# EAGLE design SensorPod (EAGLE 9.5.2)

## Sheet 1 of 3
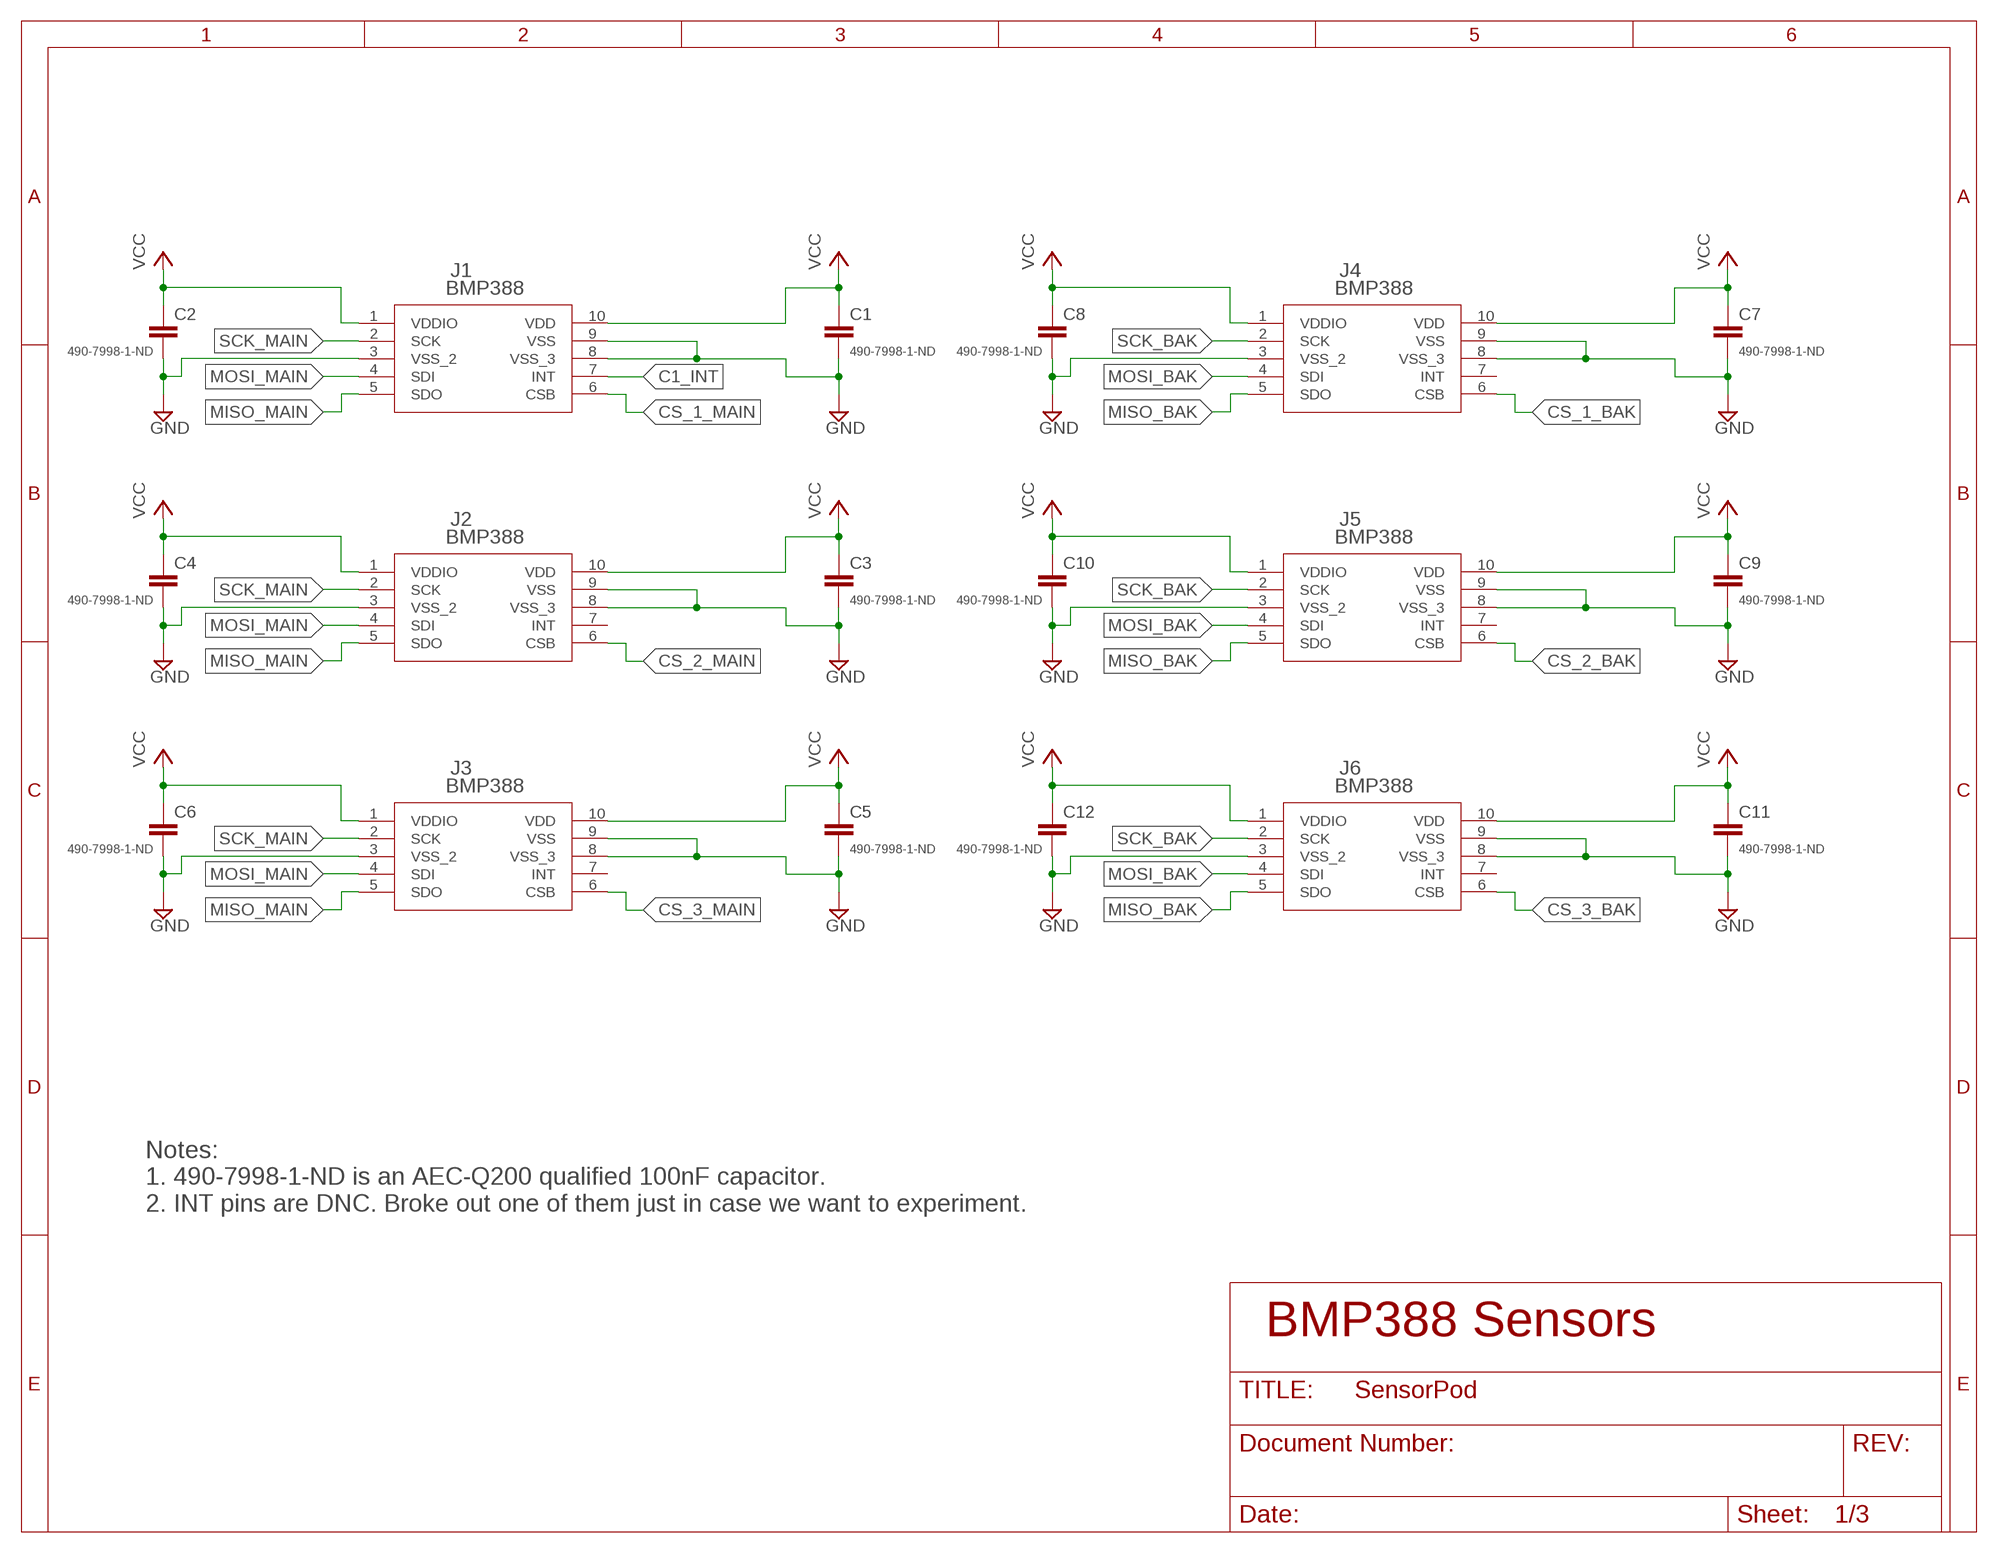
[diagram p0: schematic, sheet 1]

### Parts
C1  490-7998-1-ND  C-EUC0402  [C0402]
C2  490-7998-1-ND  C-EUC0402  [C0402]
C3  490-7998-1-ND  C-EUC0402  [C0402]
C4  490-7998-1-ND  C-EUC0402  [C0402]
C5  490-7998-1-ND  C-EUC0402  [C0402]
C6  490-7998-1-ND  C-EUC0402  [C0402]
C7  490-7998-1-ND  C-EUC0402  [C0402]
C8  490-7998-1-ND  C-EUC0402  [C0402]
C9  490-7998-1-ND  C-EUC0402  [C0402]
C10  490-7998-1-ND  C-EUC0402  [C0402]
C11  490-7998-1-ND  C-EUC0402  [C0402]
C12  490-7998-1-ND  C-EUC0402  [C0402]
J1  BMP388  [QFN_BMP388]
J2  BMP388  [QFN_BMP388]
J3  BMP388  [QFN_BMP388]
J4  BMP388  [QFN_BMP388]
J5  BMP388  [QFN_BMP388]
J6  BMP388  [QFN_BMP388]

### Nets
C1_INT: J1.7(INT) ; also sheet 2
CS_1_BAK: J4.6(CSB) ; also sheet 2
CS_1_MAIN: J1.6(CSB) ; also sheet 2
CS_2_BAK: J5.6(CSB) ; also sheet 2
CS_2_MAIN: J2.6(CSB) ; also sheet 2
CS_3_BAK: J6.6(CSB) ; also sheet 2
CS_3_MAIN: J3.6(CSB) ; also sheet 2
GND: C1.2 C2.2 C3.2 C4.2 C5.2 C6.2 C7.2 C8.2 C9.2 C10.2 C11.2 C12.2 J1.3(VSS_2) J1.8(VSS_3) J1.9(VSS) J2.3(VSS_2) J2.8(VSS_3) J2.9(VSS) J3.3(VSS_2) J3.8(VSS_3) J3.9(VSS) J4.3(VSS_2) J4.8(VSS_3) J4.9(VSS) J5.3(VSS_2) J5.8(VSS_3) J5.9(VSS) J6.3(VSS_2) J6.8(VSS_3) J6.9(VSS) ; also sheet 2,3
MISO_BAK: J4.5(SDO) J5.5(SDO) J6.5(SDO) ; also sheet 2
MISO_MAIN: J1.5(SDO) J2.5(SDO) J3.5(SDO) ; also sheet 2,3
MOSI_BAK: J4.4(SDI) J5.4(SDI) J6.4(SDI) ; also sheet 2
MOSI_MAIN: J1.4(SDI) J2.4(SDI) J3.4(SDI) ; also sheet 2,3
SCK_BAK: J4.2(SCK) J5.2(SCK) J6.2(SCK) ; also sheet 2
SCK_MAIN: J1.2(SCK) J2.2(SCK) J3.2(SCK) ; also sheet 2,3
VCC: C1.1 C2.1 C3.1 C4.1 C5.1 C6.1 C7.1 C8.1 C9.1 C10.1 C11.1 C12.1 J1.1(VDDIO) J1.10(VDD) J2.1(VDDIO) J2.10(VDD) J3.1(VDDIO) J3.10(VDD) J4.1(VDDIO) J4.10(VDD) J5.1(VDDIO) J5.10(VDD) J6.1(VDDIO) J6.10(VDD) ; also sheet 2,3
Unconnected: J2.7(INT) J3.7(INT) J4.7(INT) J5.7(INT) J6.7(INT)

### Notes on the sheet
- Notes:
  1. 490-7998-1-ND is an AEC-Q200 qualified 100nF capacitor.
  2. INT pins are DNC. Broke out one of them just in case we want to experiment.
- BMP388 Sensors

## Sheet 2 of 3
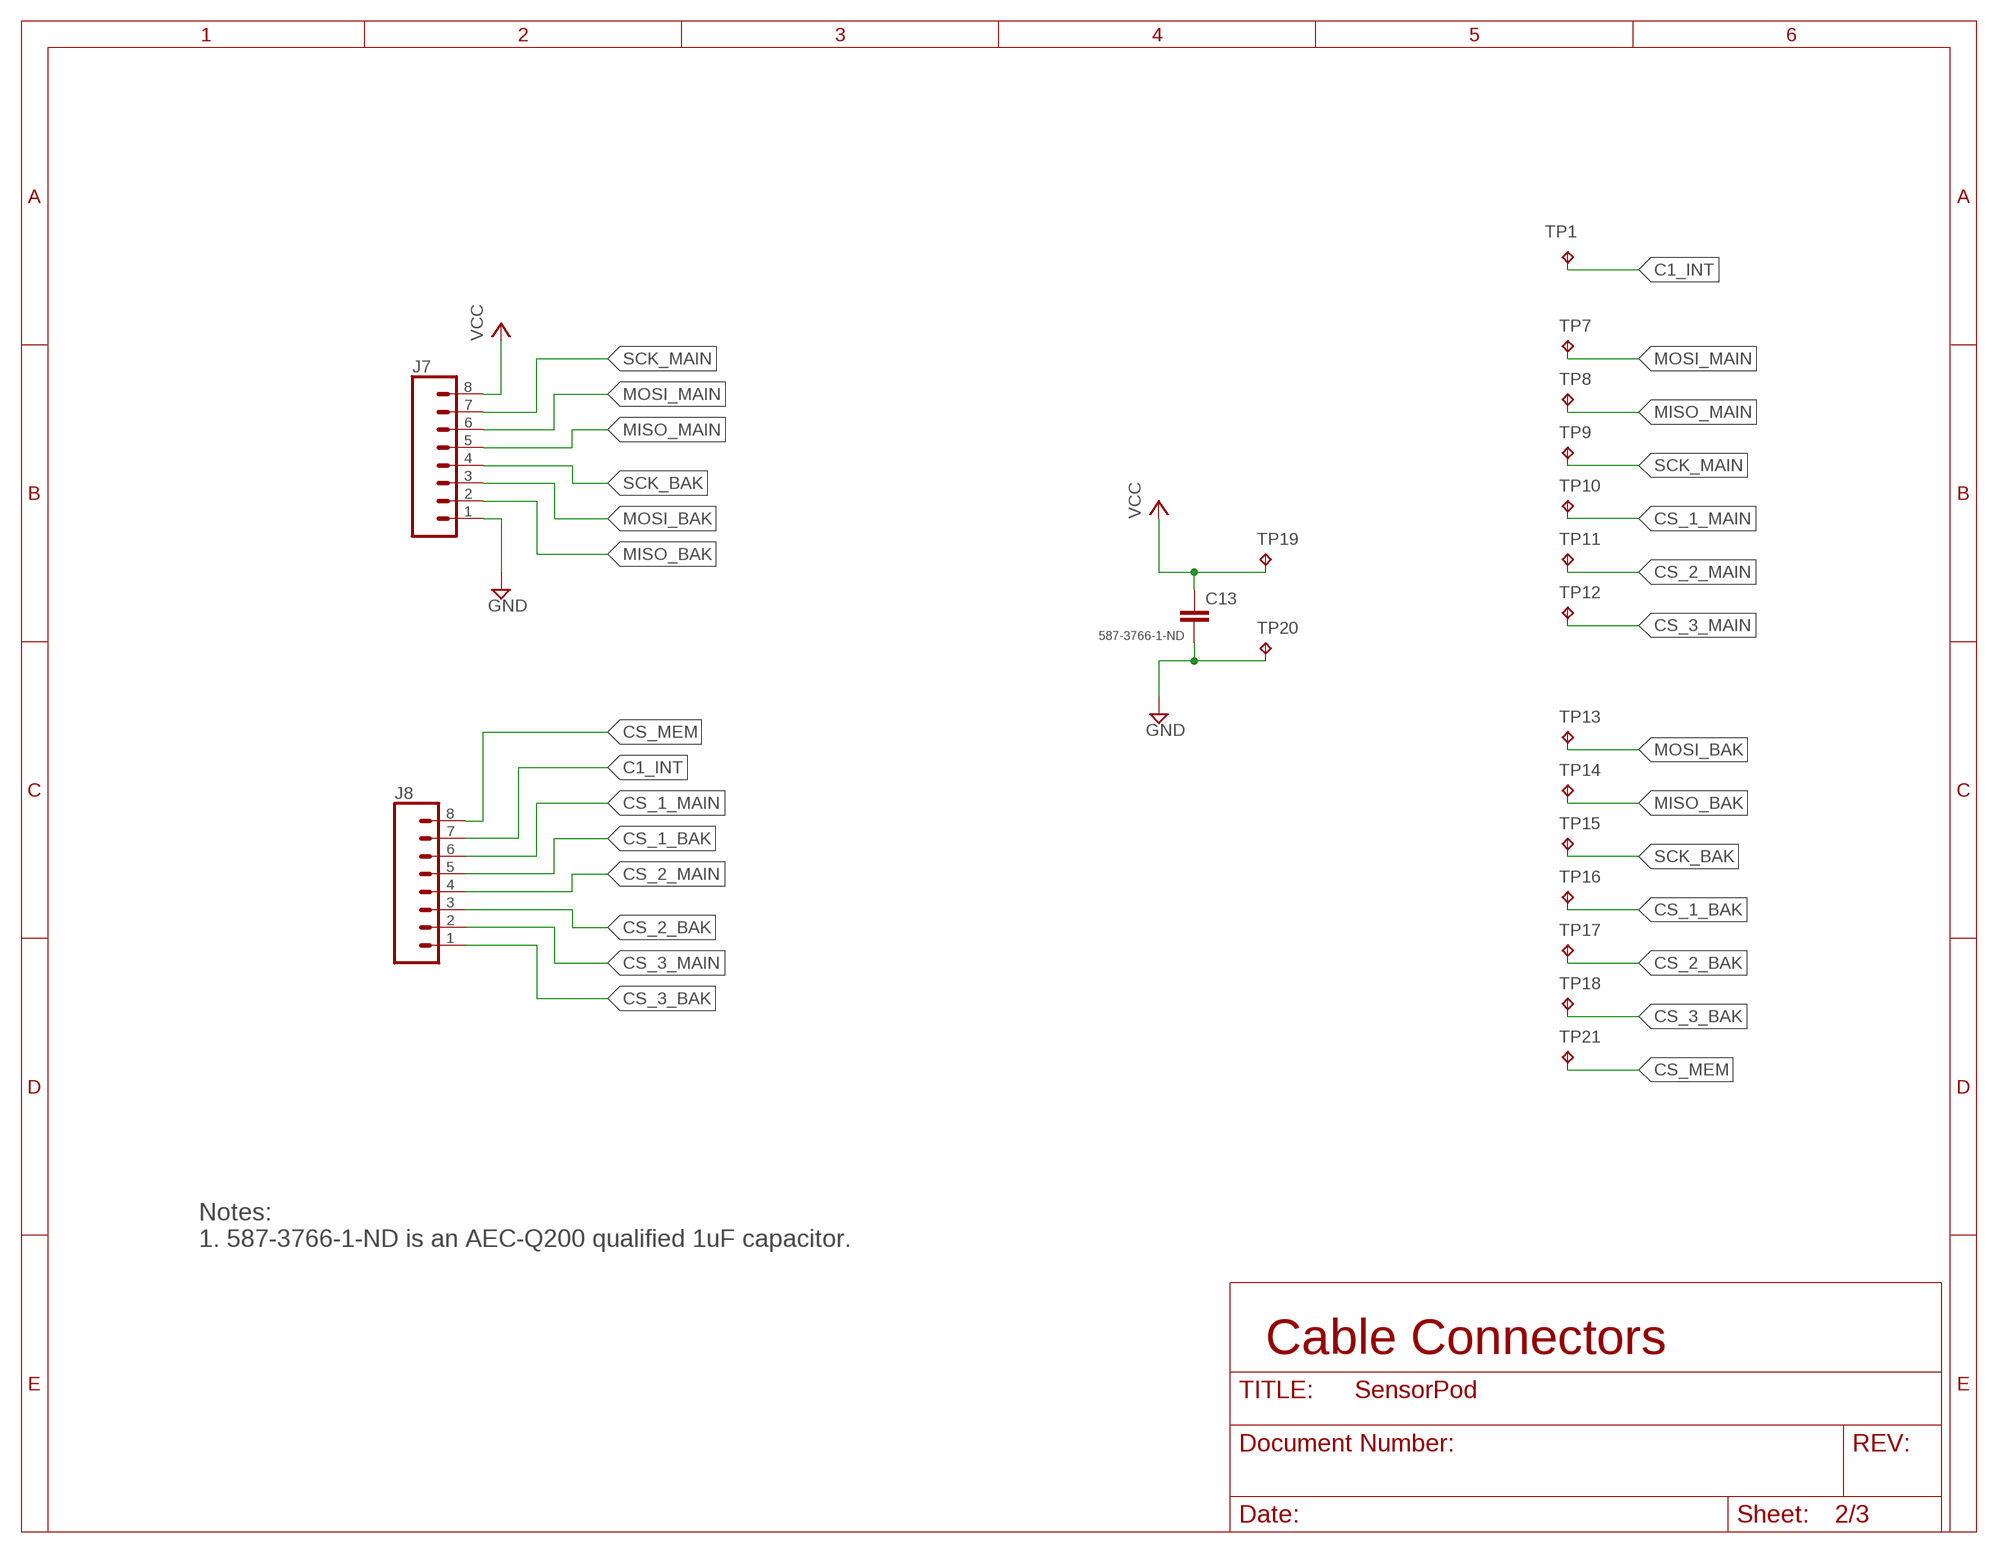
[diagram p1: schematic, sheet 2]

### Parts
C13  587-3766-1-ND  C-EUC0402  [C0402]
J7  CONN_08"  [1X08]
J8  CONN_08"  [1X08]
TP1  TPB1,27  [B1,27]
TP7  TPB1,27  [B1,27]
TP8  TPB1,27  [B1,27]
TP9  TPB1,27  [B1,27]
TP10  TPB1,27  [B1,27]
TP11  TPB1,27  [B1,27]
TP12  TPB1,27  [B1,27]
TP13  TPB1,27  [B1,27]
TP14  TPB1,27  [B1,27]
TP15  TPB1,27  [B1,27]
TP16  TPB1,27  [B1,27]
TP17  TPB1,27  [B1,27]
TP18  TPB1,27  [B1,27]
TP19  TPB1,27  [B1,27]
TP20  TPB1,27  [B1,27]
TP21  TPB1,27  [B1,27]

### Nets
C1_INT: J8.7 TP1.TP ; also sheet 1
CS_1_BAK: J8.5 TP16.TP ; also sheet 1
CS_1_MAIN: J8.6 TP10.TP ; also sheet 1
CS_2_BAK: J8.3 TP17.TP ; also sheet 1
CS_2_MAIN: J8.4 TP11.TP ; also sheet 1
CS_3_BAK: J8.1 TP18.TP ; also sheet 1
CS_3_MAIN: J8.2 TP12.TP ; also sheet 1
CS_MEM: J8.8 TP21.TP ; also sheet 3
GND: C13.2 J7.1 TP20.TP ; also sheet 1,3
MISO_BAK: J7.2 TP14.TP ; also sheet 1
MISO_MAIN: J7.5 TP8.TP ; also sheet 1,3
MOSI_BAK: J7.3 TP13.TP ; also sheet 1
MOSI_MAIN: J7.6 TP7.TP ; also sheet 1,3
SCK_BAK: J7.4 TP15.TP ; also sheet 1
SCK_MAIN: J7.7 TP9.TP ; also sheet 1,3
VCC: C13.1 J7.8 TP19.TP ; also sheet 1,3

### Notes on the sheet
- Notes:
  1. 587-3766-1-ND is an AEC-Q200 qualified 1uF capacitor.
- Cable Connectors

## Sheet 3 of 3
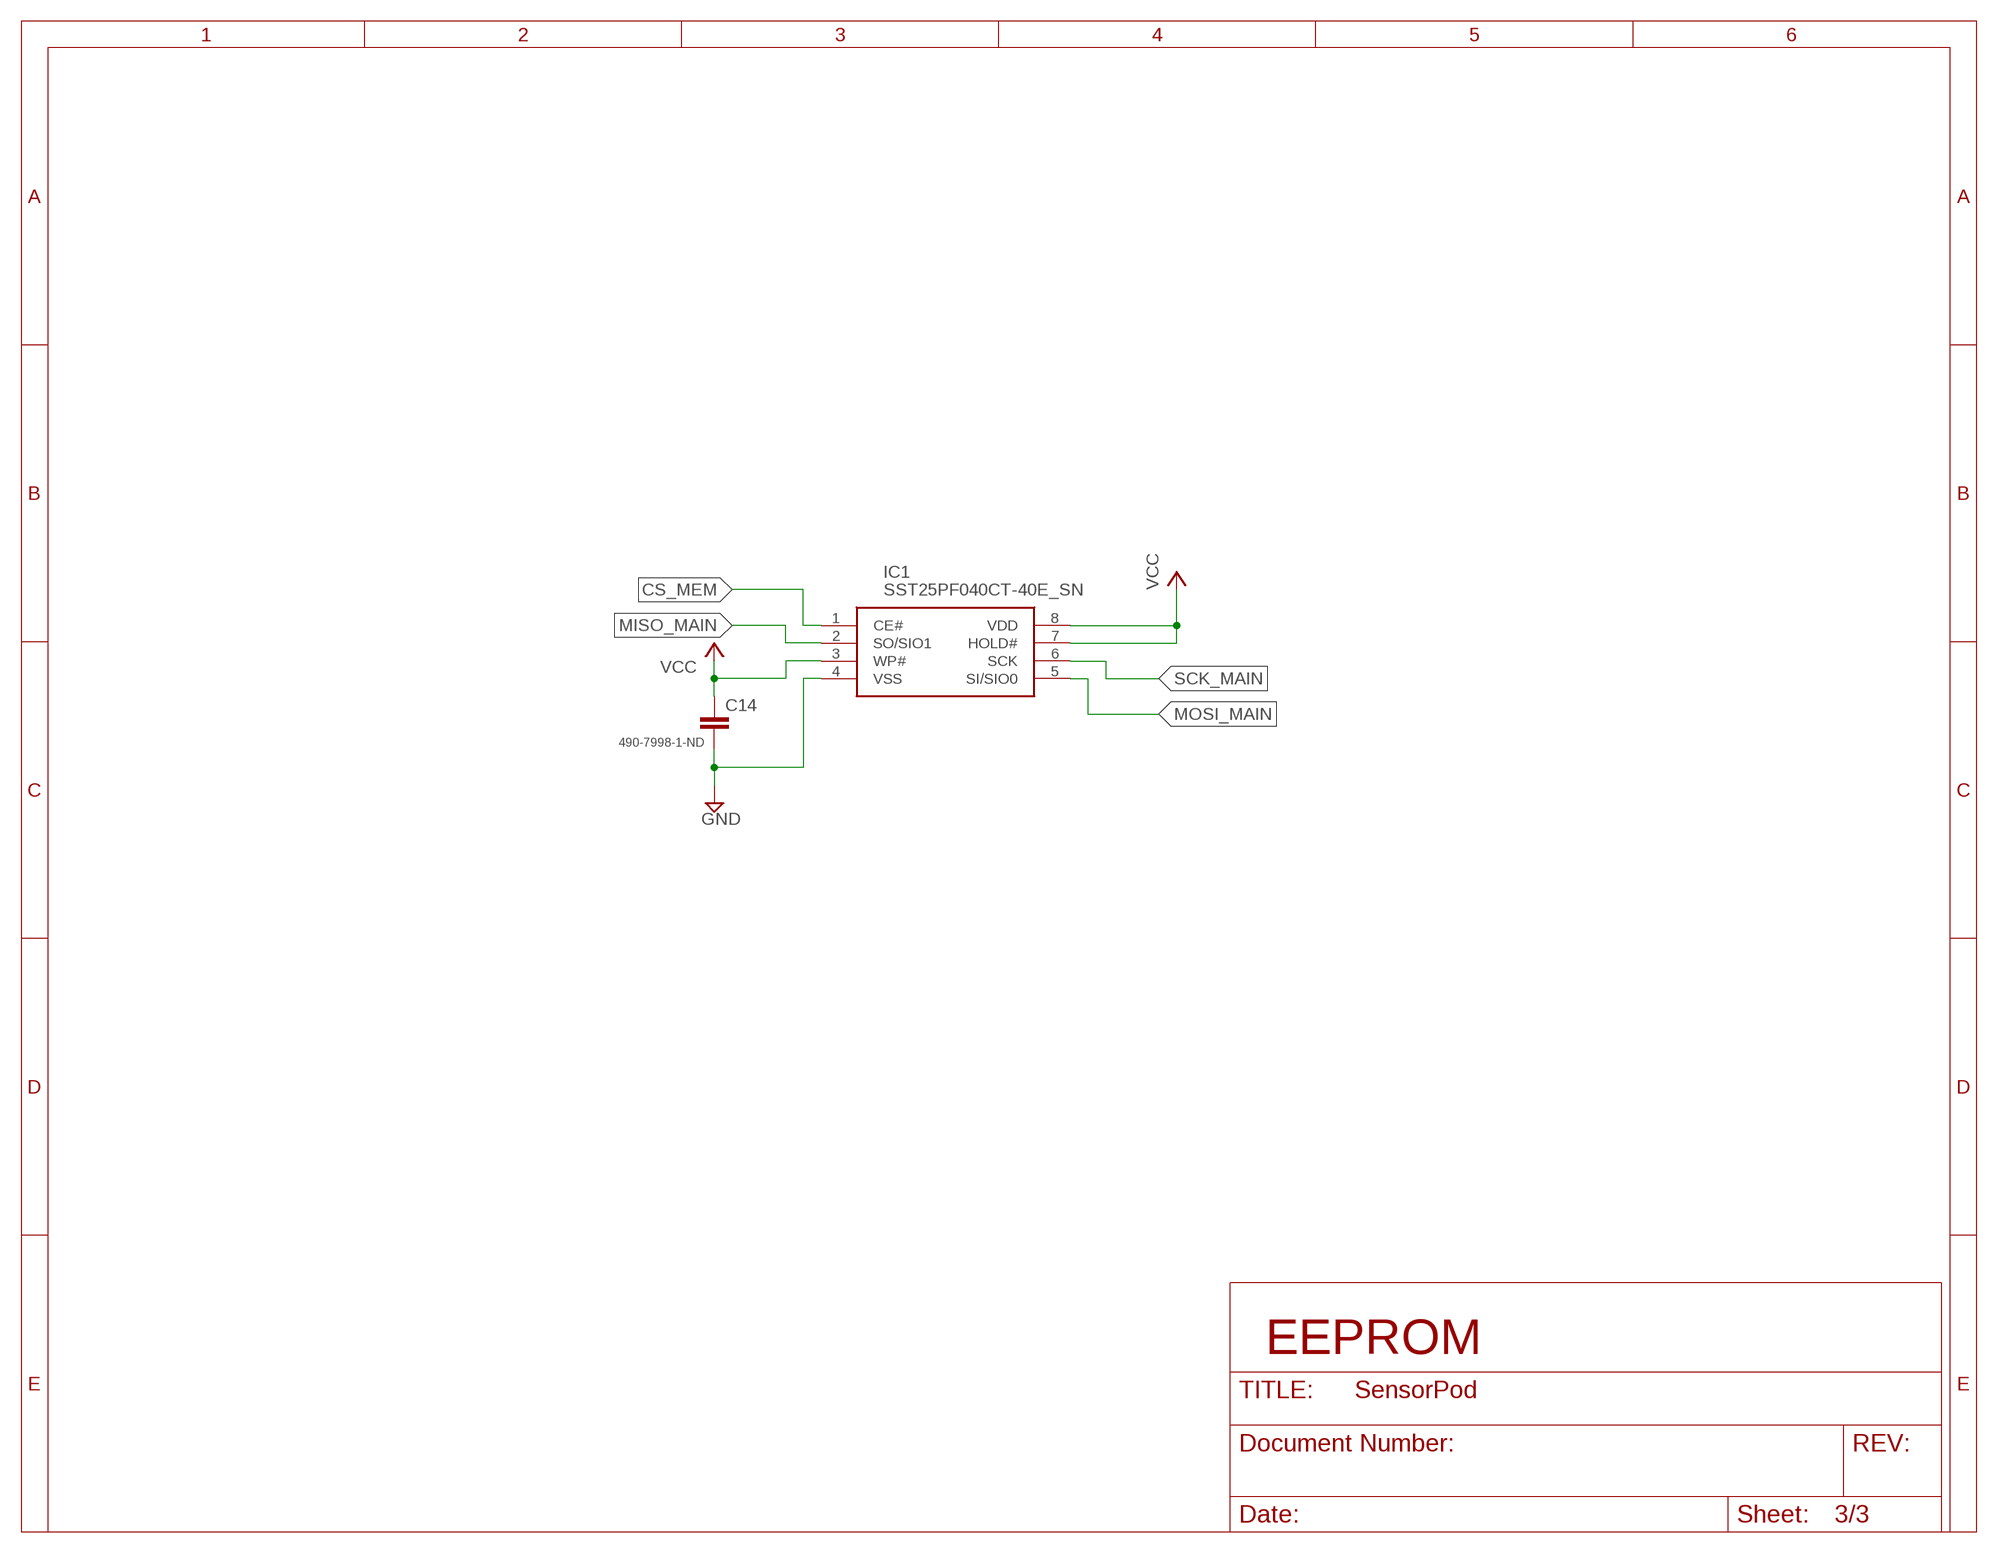
[diagram p2: schematic, sheet 3]

### Parts
C14  490-7998-1-ND  C-EUC0402  [C0402]
IC1  SST25PF040CT-40E_SN  [SOIC127P600X175-8N]

### Nets
CS_MEM: IC1.1(CE#) ; also sheet 2
GND: C14.2 IC1.4(VSS) ; also sheet 1,2
MISO_MAIN: IC1.2(SO/SIO1) ; also sheet 1,2
MOSI_MAIN: IC1.5(SI/SIO0) ; also sheet 1,2
SCK_MAIN: IC1.6(SCK) ; also sheet 1,2
VCC: C14.1 IC1.3(WP#) IC1.7(HOLD#) IC1.8(VDD) ; also sheet 1,2

### Notes on the sheet
- EEPROM

## Library data of the parts
C1-C14 = rcl:C-EU: CAPACITOR, European symbol; SPICEPREFIX: C
IC1 = SamacSys_Parts:SST25PF040CT-40E_SN: EEPROM 2.3V TO 3.6V 4Mbit SPI FLASH, 125C Industrial Source: Datasheet <https://www.mouser.com/datasheet/2/268/microchip_technology_mchp-s-a0008368847-1-1763533.pdf>; DESCRIPTION: EEPROM 2.3V TO 3.6V 4Mbit SPI FLASH, 125C Industrial; HEIGHT: 1.75mm; MANUFACTURER_NAME: Microchip; MANUFACTURER_PART_NUMBER: SST25PF040CT-40E/SN; MOUSER_PART_NUMBER: 579-T25PF040CT-40ESN; MOUSER_PRICE-STOCK: https://www.mouser.com/Search/Refine.aspx?Keyword=579-T25PF040CT-40ESN
J1-J6 = OffsetVentilatorLib:BMP388; BUILT_BY: EMA_Matt; COPYRIGHT: Copyright (C) 2018 Accelerated Designs. All rights reserved; MANUFACTURER_PART_NUMBER: BMP388; VENDOR: Bosch
J7 J8 = SparkFun-Connectors:CONN_08: Multi connection point. Often used as Generic Header-pin footprint for 0.1 inch spaced/style header connections On any of the 0.1 inch spaced packages, you can populate with these: Break Away Headers - Straight <https://www.sparkfun.com/products/116> (PRT-00116) Break Away Male Headers - Right Angle <https://www.sparkfun.com/products/553> (PRT-00553) Female Headers <https://www.sparkfun.com/products/115> (PRT-00115) Break Away Headers - Machine Pin <https://www.sparkfun.com/products/117> (PRT-00117) Break Away Female Headers - Swiss Machine Pin <https://www.sparkfun.com/products/743> (PRT-00743) Arduino Stackable Header - 8 Pin <https://www.sparkfun.com/products/9279> (PRT-09279) For SCREWTERMINALS and SPRING TERMINALS visit here: Screw Terimnals on SparkFun.com <https://www.sparkfun.com/search/results?term=Screw+Terminals> (5mm/3.5mm/2.54mm spacing) This device is also useful as a general connection point to wire up your design to another part of your project. Our various solder wires solder well into these plated through hole pads. Hook-Up Wire - Assortment (Stranded, 22 AWG) <https://www.sparkfun.com/products/11375> (PRT-11375) Hook-Up Wire - Assortment (Solid Core, 22 AWG) <https://www.sparkfun.com/products/11367> (PRT-11367) View the entire wire category on our website here <https://www.sparkfun.com/categories/141> Special notes: Molex polarized connector foot print use with SKU : PRT-08231 with associated crimp pins and housings. 1MM SMD Version SKU: PRT-10208 NOTES ON THE VARIANTS LOCK and LOCK_LONGPADS... This footprint was designed to help hold the alignment of a through-hole component (i.e. 6-pin header) while soldering it into place. You may notice that each hole has been shifted either up or down by 0.005 of an inch from it's more standard position (which is a perfectly straight line). This slight alteration caused the pins (the squares in the middle) to touch the edges of the holes. Because they are alternating, it causes a "brace" to hold the component in place. 0.005 has proven to be the perfect amount of "off-center" position when using our standard breakaway headers. Although looks a little odd when you look at the bare footprint, once you have a header in there, the alteration is very hard to notice. Also,if you push a header all the way into place, it is covered up entirely on the bottom side.; PROD_ID: CONN-08438
TP1 TP7-TP21 = testpad:TP: Test pad

## Board
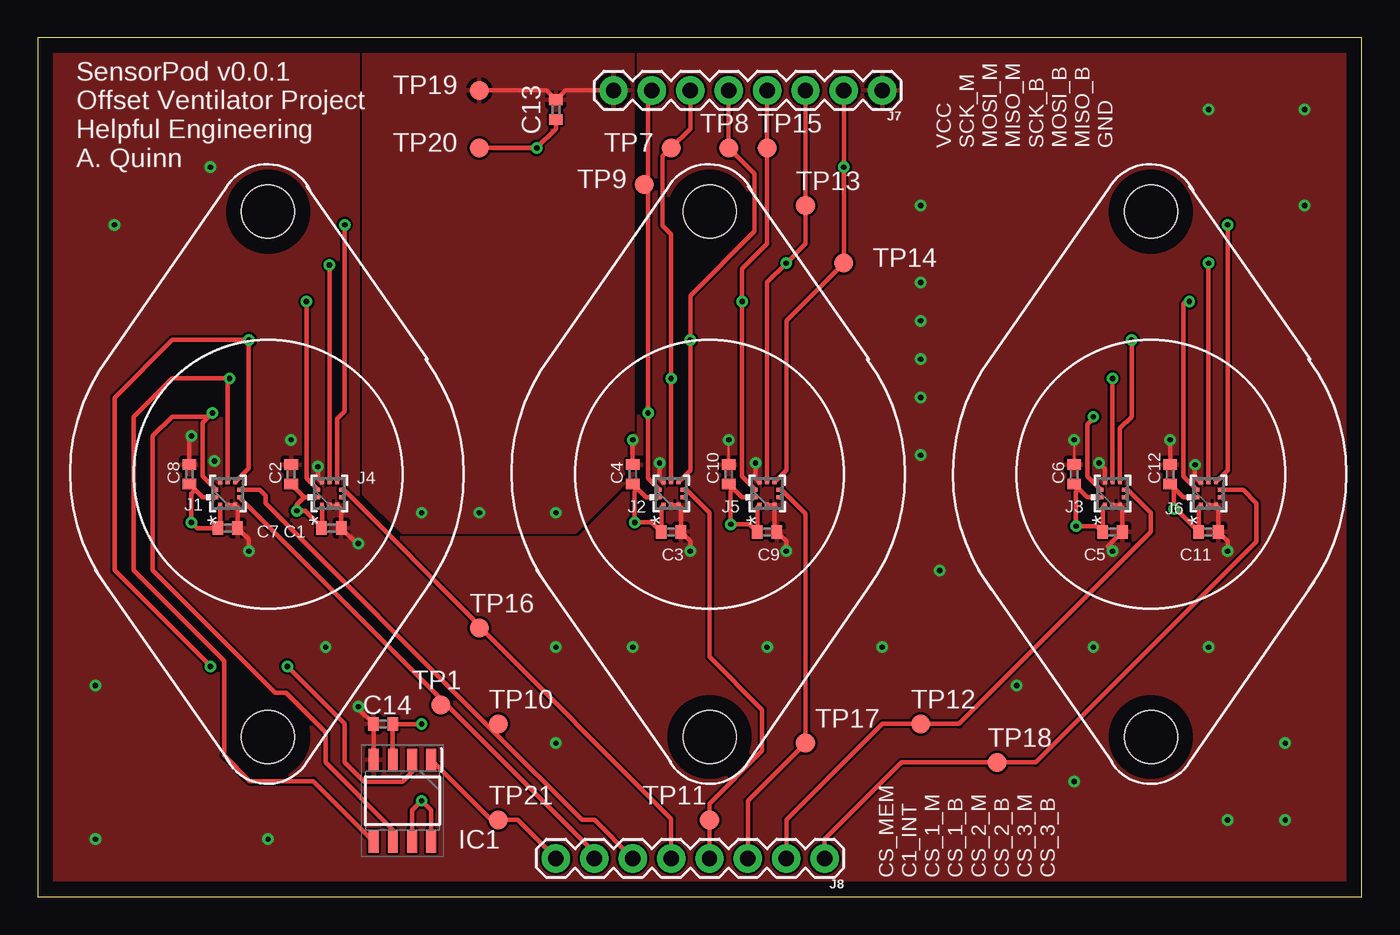
[diagram p3: board, top side]
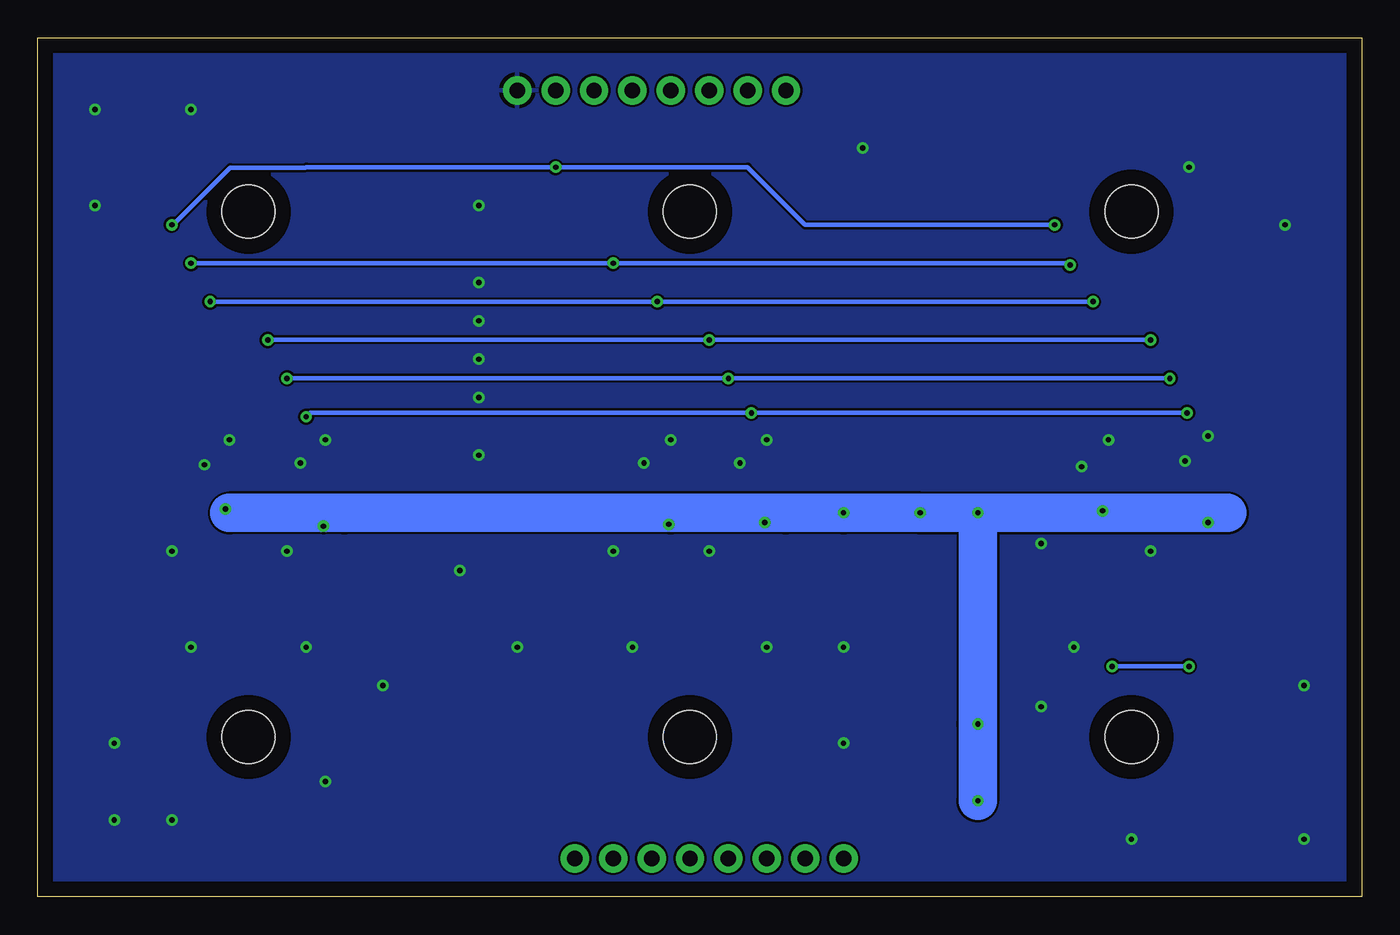
[diagram p4: board, bottom side, seen from below]

Size 87.61 x 56.82 mm. Coordinates in mm from the lower left corner, seen from the top.
Outline: 0,0 87.61,0 87.61,56.82 0,56.82 0,0
Copper layers (1*16): Top 0.035mm / dielectric 1.5mm / Bottom 0.035mm
Design rules "default": minimum track width 6mil, minimum drill 0.35mm, track to track 6mil, track to pad 6mil, pad to pad 6mil, via to via 6mil, smd to smd 6mil, copper to edge 40mil, drill to drill 6mil, minimum pad ring 10mil, minimum via ring 8mil, stop-mask expansion 4mil, vias tented up to drill 0mil, thermal gap 10mil
Holes 3.51 mm at 15.24,10.57 15.24,45.31 44.45,10.57 44.45,45.31 73.66,10.57 73.66,45.31

### Footprints (pad centres in the part's own frame; a part is rotated, then mirrored left to right if it is on the bottom)
C0402 = smd 0.7 x 0.9: 1 -0.65,0; 2 0.65,0
SOIC127P600X175-8N = smd 1.5 x 0.65: 1 -2.7,1.905; 2 -2.7,0.635; 3 -2.7,-0.635; 4 -2.7,-1.905; 5 2.7,-1.905; 6 2.7,-0.635; 7 2.7,0.635; 8 2.7,1.905
QFN_BMP388 = smd 0.254 x 0.279: 1 -0.25,0.762; 2 0.25,0.762; 6 0.25,-0.762; 7 -0.25,-0.762 | smd 0.279 x 0.254: 3 0.762,0.5; 4 0.762,0; 5 0.762,-0.5; 8 -0.762,-0.5; 9 -0.762,0; 10 -0.762,0.5
1X08 = drill 1.016 pad 1.88: 1 0,0; 2 2.54,0; 3 5.08,0; 4 7.62,0; 5 10.16,0; 6 12.7,0; 7 15.24,0; 8 17.78,0
B1,27 = smd 1.27 x 1.27: TP 0,0

### Placement (x,y rotation side)
C1  19.43,24.38 0 top
C2  16.76,27.94 90 top
C3  41.91,24.13 0 top
C4  39.37,27.94 90 top
C5  71.12,24.13 0 top
C6  68.58,27.94 90 top
C7  12.57,24.38 0 top
C8  10.03,27.94 90 top
C9  48.26,24.13 0 top
C10  45.72,27.94 90 top
C11  77.47,24.13 0 top
C12  74.93,27.94 90 top
C13  34.29,52.07 270 top
C14  22.86,11.43 180 top
IC1  24.13,6.35 270 top
J1  12.57,26.67 90 top
J2  41.91,26.67 90 top
J3  71.12,26.67 90 top
J4  19.3,26.67 90 top
J5  48.26,26.67 90 top
J6  77.47,26.67 90 top
J7  55.88,53.34 180 top
J8  52.07,2.54 180 top
TP1  26.67,12.7 0 top
TP7  41.91,49.53 0 top
TP8  45.72,49.53 0 top
TP9  40.13,47.12 0 top
TP10  30.48,11.43 0 top
TP11  44.45,5.08 0 top
TP12  58.42,11.43 0 top
TP13  50.8,45.72 0 top
TP14  53.34,41.91 0 top
TP15  48.26,49.53 0 top
TP16  29.21,17.78 0 top
TP17  50.8,10.16 0 top
TP18  63.5,8.89 0 top
TP19  29.21,53.34 0 top
TP20  29.21,49.53 0 top
TP21  30.48,5.08 0 top

### Tracks (layer width: path | path; a pad name or v marks a point on that pad's centre or on a via)
C1_INT
  Top 0.305: J1.7 26.86,12.89 | 26.86,12.89 36.83,2.92 J8.7 | TP1.TP 26.86,12.89
CS_1_BAK
  Top 0.305: J8.5 41.91,5.17 29.25,17.82 TP16.TP 29.21,17.97 20.26,26.92 J4.6
CS_1_MAIN
  Top 0.305: 30.08,11.03 36.03,5.08 36.83,5.08 J8.6 | 30.08,11.03 15.09,26.01 15.09,26.52 14.7,26.92 J1.6 | TP10.TP 30.08,11.03
CS_2_BAK
  Top 0.305: J5.6 49.22,26.92 50.8,25.34 TP17.TP 46.99,6.35 J8.3
CS_2_MAIN
  Top 0.305: J8.4 TP11.TP 44.45,6.16 47.93,9.64 47.93,12.38 44.45,15.86 44.45,25.4 42.93,26.92 J2.6
CS_3_BAK
  Top 0.305: J6.6 79.76,26.92 80.64,26.04 80.64,23.5 66.04,8.89 TP18.TP 57.15,8.89 52.07,3.81 J8.1
CS_3_MAIN
  Top 0.305: J3.6 72.14,26.92 73.66,25.4 73.66,24.13 60.96,11.43 TP12.TP 55.88,11.43 49.53,5.08 J8.2
CS_MEM
  Top 0.305: IC1.1 30,5.08 TP21.TP 31.75,5.08 J8.8
GND  (via drill 0.35)
  Top 0.152: J4.9 J4.8 | C6.2 v68.58,30.23 | 48.76,24.28 C9.2 | C10.2 v45.72,30.23
  Top 0.305: J4.8 20.08,25.63 C1.2 21.1,23.37 v21.21,23.37 | J4.3 18.54,27.69 v18.54,28.45 | J1.9 J1.8 13.22,25.76 C7.2 13.97,23.64 v13.97,22.86 | J3.3 70.62,28.31 v70.23,28.7 | C12.2 v74.93,30.23 | J6.3 76.58,27.82 v76.58,28.57 | 48.76,24.28 J5.8 J5.9 | C4.2 v39.37,30.23 | J2.3 41.15,27.69 v41.15,28.7 | J5.3 47.5,27.69 v47.5,28.7 | J2.9 J2.8 42.56,25.76 C3.2 43.18,23.51 v43.18,22.86 | J3.9 J3.8 71.77,25.76 C5.2 70.81,23.17 v71.12,22.86 | J6.9 J6.8 78.12,25.76 C11.2 78.74,23.51 v78.74,22.86 | C9.2 49.53,23.51 v49.53,22.86 | TP20.TP v33.02,49.53 34.29,50.8 C13.2 | IC1.4 22.23,11.41 C14.2 21.21,12.43 v21.21,12.57 | C8.2 10.03,30.35 v10.16,30.48
  other vias: 5.08,44.45 3.81,13.97 19.05,16.51 15.24,3.81 34.29,16.51 48.26,16.51 55.88,16.51 59.69,21.59 58.42,29.21 58.42,33.02 58.42,35.56 58.42,38.1 58.42,40.64 58.42,45.72 77.47,52.07 83.82,45.72 64.77,13.97 77.47,16.51 82.55,10.16 78.74,5.08 68.58,7.62 16.76,30.23 11.68,28.83 11.43,48.26 3.81,3.81 34.29,10.16 39.37,16.51 69.85,16.51 82.55,5.08 83.82,52.07
  pour Bottom: 0,57.15 87.63,57.15 87.63,0 0,0
  pour Top (rank 2): 0,57.15 87.63,57.15 87.63,0 0,0
MISO_BAK  (via drill 0.35)
  Top 0.305: J4.5 19.8,31.61 20.32,32.13 v20.32,44.45 | J6.5 78.74,28.2 v78.74,44.45 | J5.5 49.53,28.2 49.53,38.1 TP14.TP v53.34,48.26 J7.2
  Bottom 0.305: v78.74,44.45 78.66,44.45 74.87,48.23 69.88,48.23 69.85,48.26 v53.34,48.26 40.64,48.26 36.83,44.45 v20.32,44.45
MISO_MAIN  (via drill 0.35)
  Top 0.305: J3.5 71.62,30.98 72.39,31.75 v72.39,36.83 | J2.5 43.18,28.2 v43.18,36.83 43.18,39.77 47.42,44.01 47.42,47.83 TP8.TP J7.5 | J1.5 13.97,28.33 v13.97,36.83 8.89,36.83 5.08,33.02 5.08,21.59 v11.43,15.24 | IC1.2 24.77,8.26 24.13,7.62 21.59,7.62 20.32,8.89 20.32,11.43 v16.51,15.24
  Bottom 0.305: v13.97,36.83 v43.18,36.83 v72.39,36.83 | v11.43,15.24 v16.51,15.24
MOSI_BAK  (via drill 0.35)
  Top 0.305: J7.3 TP13.TP 50.8,43.18 v49.53,41.91 48.26,40.64 J5.4 | J6.4 v77.47,41.91 | J4.4 v19.3,41.78
  Bottom 0.305: v19.3,41.78 19.43,41.91 v49.53,41.91 v77.47,41.91
MOSI_MAIN  (via drill 0.35)
  Top 0.152: 12.57,34.16 v12.7,34.29
  Top 0.305: J7.6 43.18,50.8 TP7.TP 41.35,48.97 41.35,44.39 41.91,43.83 v41.91,34.29 J2.4 | J1.4 12.57,34.16 | J3.4 v71.12,34.29 | v12.7,34.29 8.89,34.29 6.35,31.75 6.35,21.59 12.32,15.62 12.32,9.36 14.03,7.64 18.23,7.64 IC1.5
  Bottom 0.305: v12.7,34.29 v41.91,34.29 v71.12,34.29
SCK_BAK  (via drill 0.35)
  Top 0.305: J4.2 17.78,27.68 v17.78,39.37 | J6.2 75.82,27.81 75.82,39.24 75.95,39.37 v76.2,39.37 | J5.2 46.61,27.81 v46.61,39.37 46.61,41.53 48.26,43.18 TP15.TP J7.4
  Bottom 0.305: v76.2,39.37 v46.61,39.37 v17.78,39.37
SCK_MAIN  (via drill 0.35)
  Top 0.152: 40.39,53.09 J7.7
  Top 0.305: J1.2 10.92,27.81 10.92,31.37 v11.56,32 11.3,31.75 8.89,31.75 7.62,30.48 7.62,21.59 15.72,13.49 16.45,13.49 19.05,10.89 19.05,8.89 23.5,4.45 IC1.6 | J3.2 69.47,27.81 69.47,31.24 69.85,31.62 v69.85,31.75 | J2.2 40.39,27.68 v40.39,32 40.39,46.99 | 40.39,46.99 40.39,53.09 | TP9.TP 40.26,47.12 40.39,46.99
  Bottom 0.152: 69.6,32 v69.85,31.75
  Bottom 0.305: 69.6,32 v40.39,32 v11.56,32
VCC  (via drill 0.35)
  Top 0.152: 18.8,24.41 C1.1 | 12.07,24.53 C7.1
  Top 0.305: J4.10 18.8,24.41 17.68,25.53 v17.14,25.53 17.14,25.93 17.63,26.42 | J4.1 17.63,26.42 | 17.63,26.42 C2.1 | J1.1 10.9,26.42 10.41,26.92 | 10.41,26.92 C8.1 | J1.10 12.07,24.53 | J6.10 76.82,25.76 C11.1 75.3,25.65 v75.18,25.65 | J3.1 69.45,26.42 68.89,26.98 | 68.89,26.98 C6.1 | J6.1 75.8,26.42 75.24,26.98 | 75.24,26.98 C12.1 75.18,27.04 v75.18,25.65 | J2.1 40.24,26.42 39.68,26.98 | 39.68,26.98 C4.1 | J5.1 46.59,26.42 46.03,26.98 | 46.03,26.98 C10.1 | J2.10 41.26,25.76 C3.1 40.62,24.77 v39.5,24.77 39.5,26.8 39.68,26.98 | J5.10 47.61,25.76 C9.1 47.1,24.64 v45.85,24.64 45.85,26.8 46.03,26.98 | J7.8 34.91,53.34 C13.1 33.67,53.34 TP19.TP | IC1.3 23.5,11.41 | 23.5,11.41 C14.1 | 10.41,26.92 10.16,26.67 v10.16,24.77 10.54,24.38 C7.1 | IC1.7 24.77,5.71 v25.4,6.35 26.04,5.71 IC1.8 | v25.4,11.43 25.39,11.41 23.5,11.41 | 68.89,26.98 68.71,26.8 v68.71,24.51 70.09,24.51 C5.1 70.47,25.76 J3.10 | v75.18,25.65 75.18,26.92 75.24,26.98
  Bottom 0.305: v39.5,24.77 38.86,25.4 38.1,25.4 | v45.85,24.64 45.72,24.77 45.72,25.4 | 74.93,25.4 v75.18,25.65 | v68.71,24.51 67.82,25.4 67.31,25.4 | 8.89,25.4 9.53,24.77 v10.16,24.77 | v17.14,25.53 17.02,25.4 16.51,25.4
  Bottom 2.54: v25.4,25.4 16.51,25.4 8.89,25.4 | v25.4,25.4 v29.21,25.4 v34.29,25.4 38.1,25.4 45.72,25.4 67.31,25.4 74.93,25.4 | v25.4,25.4 v25.4,11.43 v25.4,6.35
  pour Top: 39.37,57.15 21.59,57.15 21.59,26.67 24.13,24.13 35.56,24.13 39.37,27.94

### Text on the board
tNames: VCC / SCK_M / MOSI_M / MISO_M / SCK_B / MOSI_B / MISO_B / GND | SensorPod v0.0.1 / Offset Ventilator Project / Helpful Engineering / A. Quinn | CS_MEM / C1_INT / CS_1_M / CS_1_B / CS_2_M / CS_2_B / CS_3_M / CS_3_B